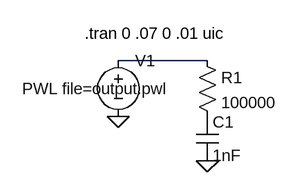
[diagram p0: schematic testpwl.asc]
testpwl.asc, the LTspice schematic file:
Version 4
SHEET 1 880 680
WIRE 208 112 80 112
FLAG 80 192 0
FLAG 208 256 0
SYMBOL voltage 80 96 R0
WINDOW 3 -138 56 Left 2
WINDOW 123 0 0 Left 2
WINDOW 39 0 0 Left 2
SYMATTR Value PWL file=output.pwl
SYMATTR InstName V1
SYMBOL res 192 96 R0
SYMATTR InstName R1
SYMATTR Value 100000
SYMBOL cap 192 192 R0
SYMATTR InstName C1
SYMATTR Value 1nF
TEXT 32 72 Left 2 !.tran 0 .07 0 .01 uic

The netlist it stands for:
* testpwl.asc
V1 N001 0 PWL file=output.pwl
R1 N001 P001 100000
C1 P001 0 1nF
.tran 0 .07 0 .01 uic
.backanno
.end